# EasyEDA Pro project 数字电容表（嘉立创专业版）.epro, schematic 数字电容表原理图
Create Date: 2023-10-29; Page Name: P1; Project Name: STC12C5A32S2; Schematic Name: 数字电容表原理图; Update Date: 2023-12-10; Company: 嘉立创EDA; Page Size: A3; Version: V1.0
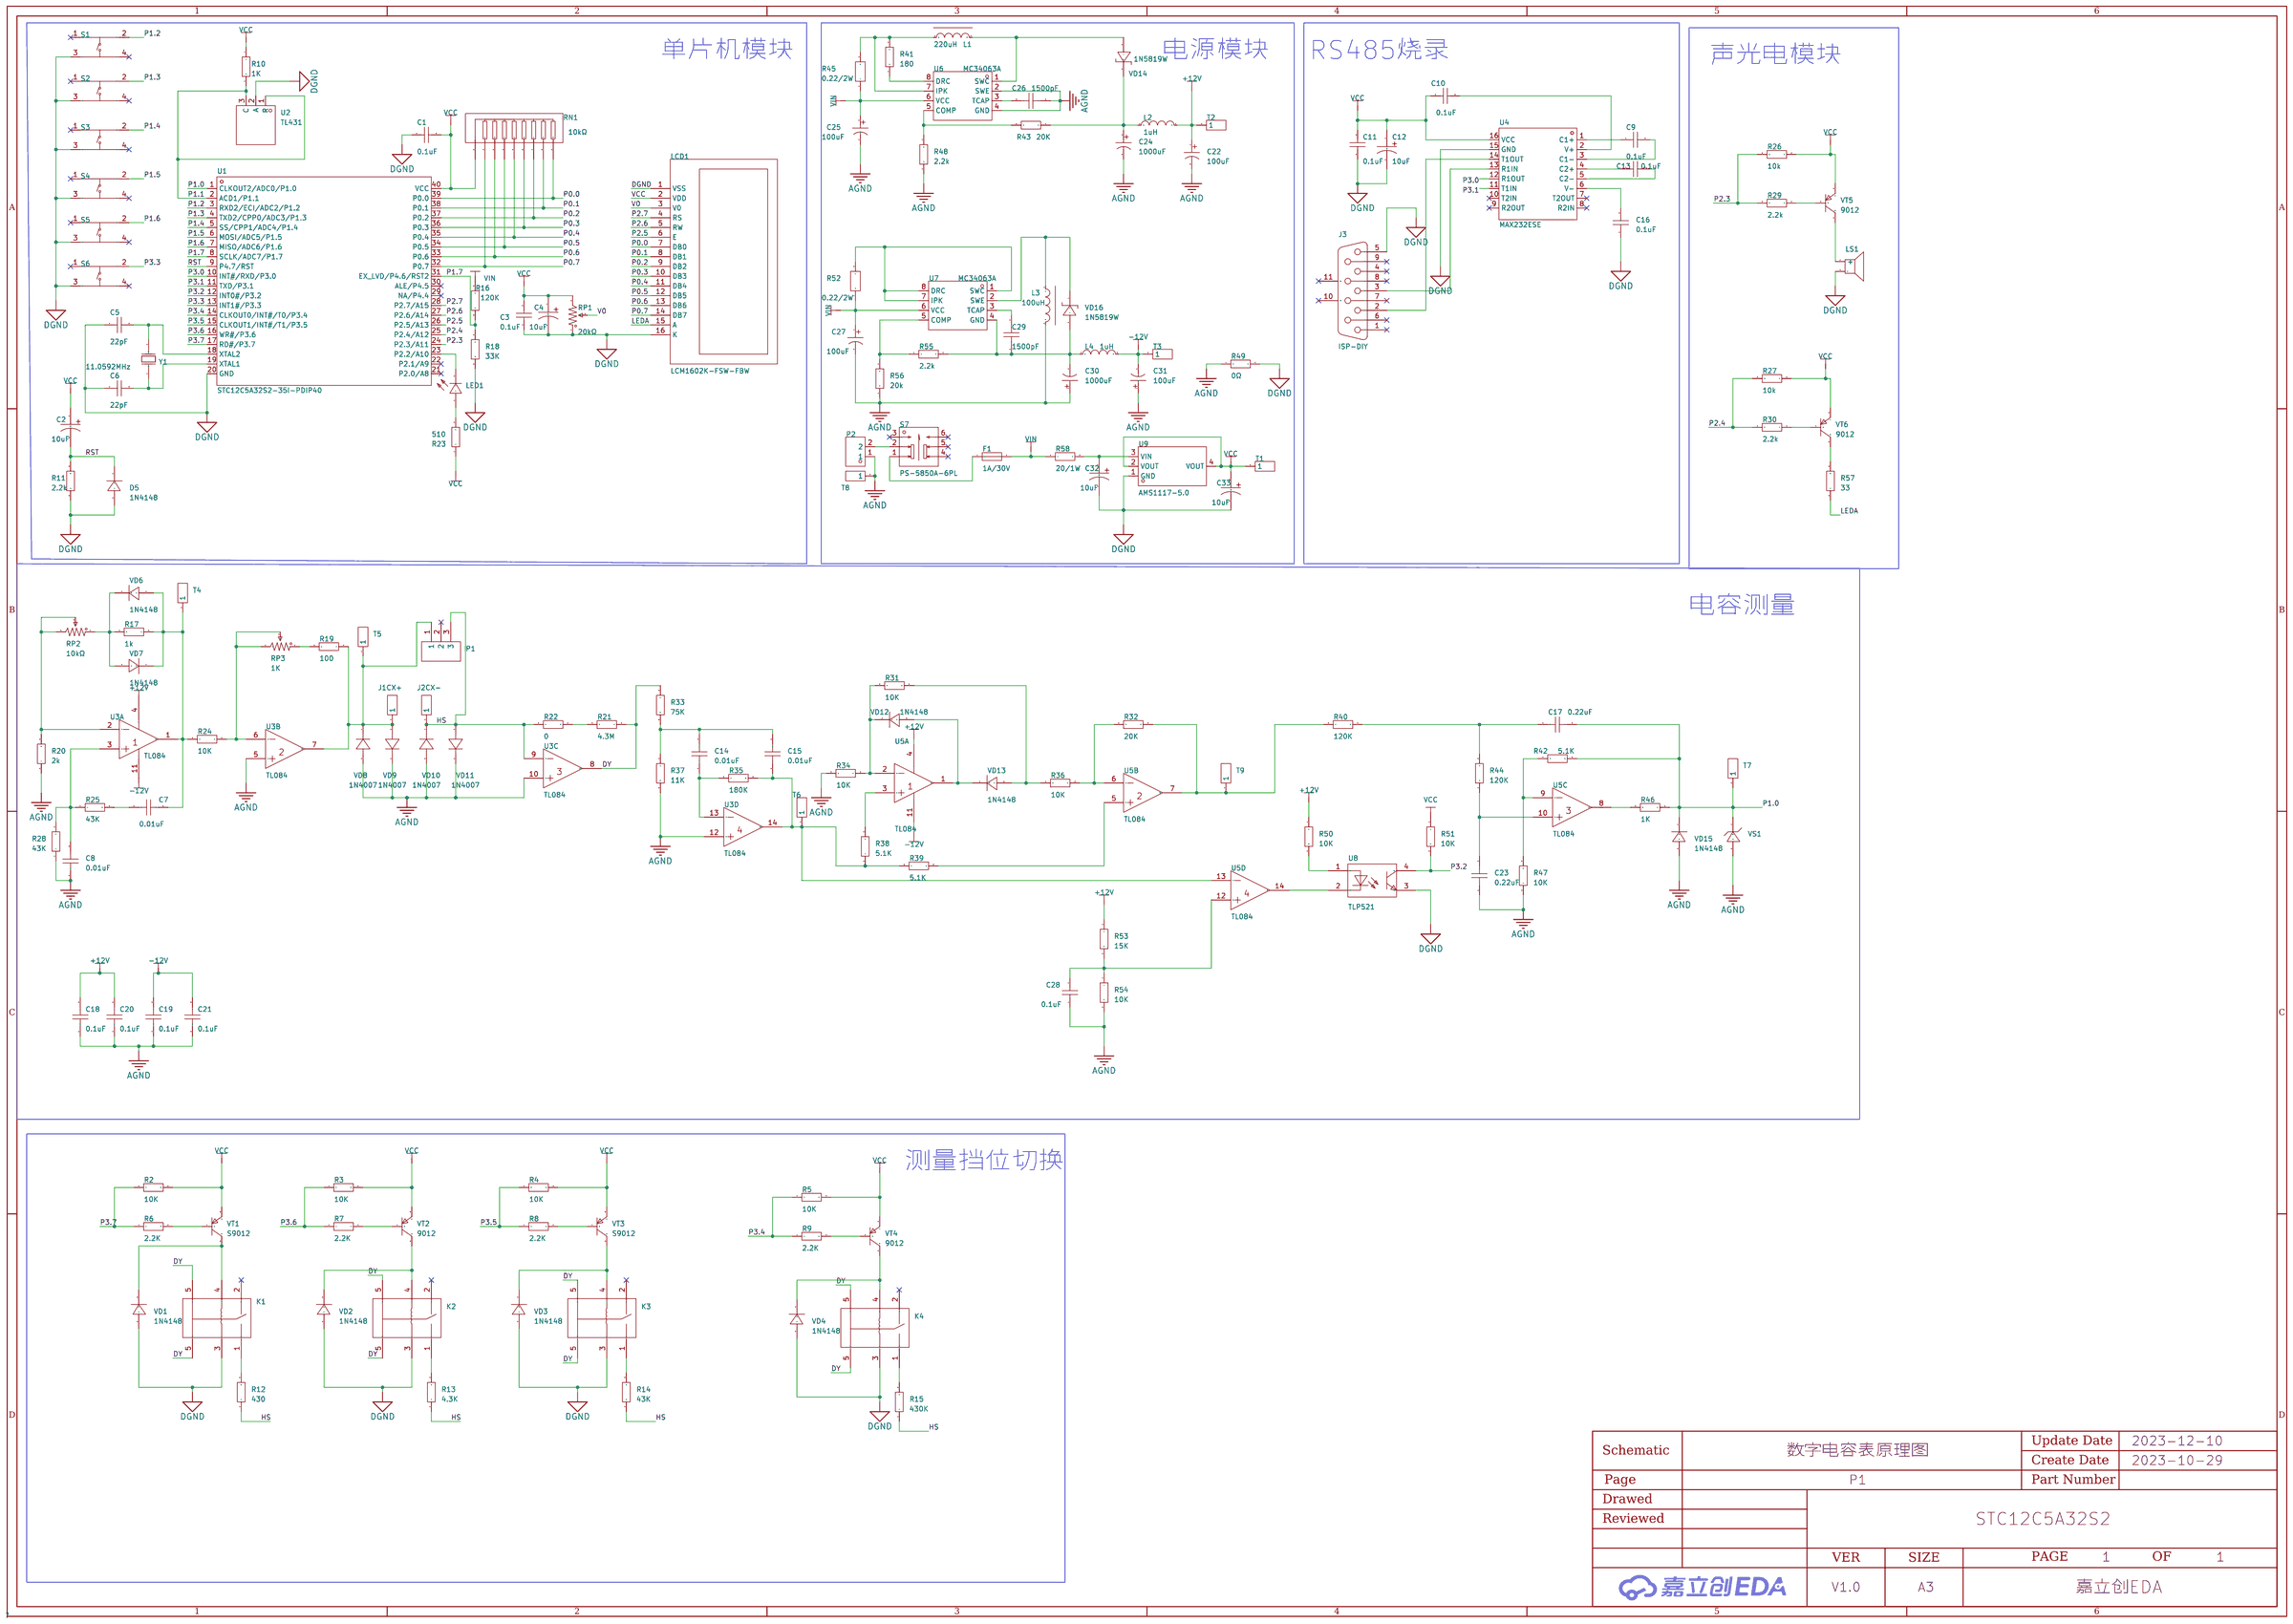
[diagram p0: schematic sheet]

## Parts
C1  0.1uF  [R0805_NEW]
C2  10uF  [CAP-SMD_L3.2-W1.6]
C3  0.1uF  [R0805_NEW]
C4  10uF  [CAP-SMD_L3.2-W1.6]
C5  22pF  [R0805_NEW]
C6  22pF  [R0805_NEW]
C7  0.01uF  [CAP-TH_L6.5-W3.5-P5.00-D0.6]
C8  0.01uF  [CAP-TH_L6.5-W3.5-P5.00-D0.6]
C9  0.1uF  [R0805_NEW]
C10  0.1uF  [R0805_NEW]
C11  0.1uF  [R0805_NEW]
C12  10uF  [CAP-SMD_L3.2-W1.6]
C13  0.1uF  [R0805_NEW]
C14  0.01uF  [CAP-TH_L6.5-W3.5-P5.00-D0.6]
C15  0.01uF  [CAP-TH_L6.5-W3.5-P5.00-D0.6]
C16  0.1uF  [R0805_NEW]
C17  0.22uF  [CAP-TH_L6.5-W3.5-P5.00-D0.6]
C18  0.1uF  [C0805]
C19  0.1uF  [C0805]
C20  0.1uF  [C0805]
C21  0.1uF  [C0805]
C22  100uF  [CAP-TH_BD6.3-P2.50-D1.0-FD]
C23  0.22uF  [CAP-TH_L6.5-W3.5-P5.00-D0.6]
C24  1000uF  [CAP-TH_BD10.0-P5.00-D1.0-FD]
C25  100uF  [CAP-TH_BD6.3-P2.50-D1.0-FD]
C26  1500pF  [CAP-TH_L6.5-W3.5-P5.00-D0.6]
C27  100uF  [CAP-TH_BD6.3-P2.50-D1.0-FD]
C28  0.1uF  [R0805_NEW]
C29  1500pF  [CAP-TH_L6.5-W3.5-P5.00-D0.6]
C30  1000uF  [CAP-TH_BD10.0-P5.00-D1.0-FD]
C31  100uF  [CAP-TH_BD6.3-P2.50-D1.0-FD]
C32  10uF  [CAP-SMD_L3.2-W1.6]
C33  10uF  [CAP-SMD_L3.2-W1.6]
D5  1N4148  [LL-34_L3.5-W1.5-RD]
F1  1A/30V  [FUSE-TH_L7.4-W3.1-P5.08-D1.2]
J1  J1CX+  [HDR-TH_1P-V-M_XKB_X4611WV-01I-C28D40]
J2  J2CX-  [HDR-TH_1P-V-M_XKB_X4611WV-01I-C28D40]
J3  ISP-DIY  [DSUB-TH_DMR-9S]
K1  HK4100F-DC5V-SHG  [RELAY-TH_HK4100F-DC5V-SHG]
K2  HK4100F-DC5V-SHG  [RELAY-TH_HK4100F-DC5V-SHG]
K3  HK4100F-DC5V-SHG  [RELAY-TH_HK4100F-DC5V-SHG]
K4  HK4100F-DC5V-SHG  [RELAY-TH_HK4100F-DC5V-SHG]
L1  220uH  [IND-TH_BD9.0-P5.00-D0.7]
L2  1uH  [IND-TH_BD3.0-L8.0-P12.00-D0.6]
L3  100uH  [IND-TH_BD9.5-P5.00-D0.7]
L4  1uH  [IND-TH_BD3.0-L8.0-P12.00-D0.6]
LCD1  LCM1602K-FSW-FBW  [MODULE-TH_LCM1602K]
LED1  204-10SUGD/S400-A5  [LED-TH_BD3.0-P2.54-FD]
LS1  2.3kHz  [BUZ-TH_BD12.0-P7.60-D0.6-FD]
P1  B3B-XH-A(LF)(SN)  [CONN-TH_3P-P2.50_A2501WV2-3P]
P2  PZ254V-11-02P  [HDR-TH_2P-P2.54-V-M]
R2  10K  [R0805]
R3  10K  [R0805]
R4  10K  [R0805]
R5  10K  [R0805]
R6  2.2K  [R0805]
R7  2.2K  [R0805]
R8  2.2K  [R0805]
R9  2.2K  [R0805]
R10  1K  [R0805]
R11  2.2k  [R0805]
R12  430  [R0805]
R13  4.3K  [R0805]
R14  43K  [R0805]
R15  430K  [R0805]
R16  120K  [R0805]
R17  1k  [R0805]
R18  33K  [R0805]
R19  100  [R0805]
R20  2k  [R0805]
R21  4.3M  [R0805]
R22  0  [R0805]
R23  510  [R0805]
R24  10K  [R0805]
R25  43K  [R0805]
R26  10k  [R0805]
R27  10k  [R0805]
R28  43K  [R0805]
R29  2.2k  [R0805]
R30  2.2k  [R0805]
R31  10K  [R0805]
R32  20K  [R0805]
R33  75K  [R0805]
R34  10K  [R0805]
R35  180K  [R0805]
R36  10K  [R0805]
R37  11K  [R0805]
R38  5.1K  [R0805]
R39  5.1K  [R0805]
R40  120K  [R0805]
R41  180  [R0805]
R42  5.1K  [R0805]
R43  20K  [R0805]
R44  120K  [R0805]
R45  0.22/2W  [RES-TH_BD4.5-L11.0-P15.00-D0.7]
R46  1K  [R0805]
R47  10K  [R0805]
R48  2.2k  [R0805]
R49  0Ω  [RES-TH_BD2.4-L6.3-P10.30-D0.6]
R50  10K  [R0805]
R51  10K  [R0805]
R52  0.22/2W  [RES-TH_BD4.5-L11.0-P15.00-D0.7]
R53  15K  [R0805]
R54  10K  [R0805]
R55  2.2k  [R0805]
R56  20k  [R0805]
R57  33  [R0805]
R58  20/1W  [RES-TH_BD4.5-L11.0-P15.00-D0.7]
RN1  10kΩ  [RES-ARRAY-TH_9P-P2.54-D1.0]
RP1  20kΩ  [RES-ADJ-TH_3P-L10.0-W10.0-P2.50-L]
RP2  10kΩ  [RES-ADJ-TH_3P-L10.0-W10.0-P2.50-L]
RP3  1K  [RES-ADJ-TH_3P-L10.0-W10.0-P2.50-L]
S1  TS665CJ  [SW-TH_4P-L6.0-W6.0-P4.50-LS6.5]
S2  TS665CJ  [SW-TH_4P-L6.0-W6.0-P4.50-LS6.5]
S3  TS665CJ  [SW-TH_4P-L6.0-W6.0-P4.50-LS6.5]
S4  TS665CJ  [SW-TH_4P-L6.0-W6.0-P4.50-LS6.5]
S5  TS665CJ  [SW-TH_4P-L6.0-W6.0-P4.50-LS6.5]
S6  TS665CJ  [SW-TH_4P-L6.0-W6.0-P4.50-LS6.5]
S7  PS-5850A-6PL  [SW-TH_6P-L5.8-W5.8-P2.00-LS4.5-BL]
T1  -  [HDR-TH_1P-V-M_XKB_X4611WV-01I-C28D40]
T2  -  [HDR-TH_1P-V-M_XKB_X4611WV-01I-C28D40]
T3  -  [HDR-TH_1P-V-M_XKB_X4611WV-01I-C28D40]
T4  -  [HDR-TH_1P-V-M_XKB_X4611WV-01I-C28D40]
T5  -  [HDR-TH_1P-V-M_XKB_X4611WV-01I-C28D40]
T6  -  [HDR-TH_1P-V-M_XKB_X4611WV-01I-C28D40]
T7  -  [HDR-TH_1P-V-M_XKB_X4611WV-01I-C28D40]
T8  -  [HDR-TH_1P-V-M_XKB_X4611WV-01I-C28D40]
T9  -  [HDR-TH_1P-V-M_XKB_X4611WV-01I-C28D40]
U1  STC12C5A32S2-35I-PDIP40  [DIP-40_L52.3-W13.9-P2.54-LS15.2-BL]
U2  TL431  [TO-92-3_L4.9-W3.7-P1.27-L]
U3  TL084  [DIP-14_L18.9-W6.4-P2.54-LS7.6-BL]  (sections 1,2,3,4)
U4  MAX232ESE  [SOP-16_L10.0-W3.9-P1.27-LS6.0-BL]
U5  TL084  [DIP-14_L18.9-W6.4-P2.54-LS7.6-BL]  (sections 1,2,3,4)
U6  MC34063A  [SOIC-8_L4.9-W3.9-P1.27-LS6.0-BL]
U7  MC34063A  [SOIC-8_L4.9-W3.9-P1.27-LS6.0-BL]
U8  TLP521  [DIP-4_L6.4-W4.6-P2.54-LS7.6-BL]
U9  AMS1117-5.0  [SOT-223_L6.5-W3.5-P2.30-LS7.0-BR]
VD1  1N4148  [LL-34_L3.5-W1.5-RD]
VD2  1N4148  [LL-34_L3.5-W1.5-RD]
VD3  1N4148  [LL-34_L3.5-W1.5-RD]
VD4  1N4148  [LL-34_L3.5-W1.5-RD]
VD6  1N4148  [LL-34_L3.5-W1.5-RD]
VD7  1N4148  [LL-34_L3.5-W1.5-RD]
VD8  1N4007  [SMA_L4.3-W2.5-LS5.0-RD]
VD9  1N4007  [SMA_L4.3-W2.5-LS5.0-RD]
VD10  1N4007  [SMA_L4.3-W2.5-LS5.0-RD]
VD11  1N4007  [SMA_L4.3-W2.5-LS5.0-RD]
VD12  1N4148  [LL-34_L3.5-W1.5-RD]
VD13  1N4148  [LL-34_L3.5-W1.5-RD]
VD14  1N5819W  [SMA_L4.3-W2.5-LS5.0-RD]
VD15  1N4148  [LL-34_L3.5-W1.5-RD]
VD16  1N5819W  [SMA_L4.3-W2.5-LS5.0-RD]
VS1  1N4733A  [DO-41_BD2.4-L4.7-P8.70-D0.9-RD]
VT1  S9012  [SOT-23-3_L2.9-W1.3-P1.90-LS2.4-BR]
VT2  9012  [SOT-23-3_L2.9-W1.3-P1.90-LS2.4-BR]
VT3  S9012  [SOT-23-3_L2.9-W1.3-P1.90-LS2.4-BR]
VT4  9012  [SOT-23-3_L2.9-W1.3-P1.90-LS2.4-BR]
VT5  9012  [SOT-23-3_L2.9-W1.3-P1.90-LS2.4-BR]
VT6  9012  [SOT-23-3_L2.9-W1.3-P1.90-LS2.4-BR]
Y1  11.0592MHz  [HC-49US_L11.5-W4.5-P4.88]

## Library data of the parts
C1 C3 C5 C6 C9-C11 C13 C16 C28 = C1608NP01H220J080AA: 容值:22pF;额定电压:50V;材质(温度系数):C0G;; LCSC Part Name: 22pF 50V; Supplier Part: C3893275; Manufacturer: TDK; Supplier: LCSC; Voltage Rated: 50V; Temperature Coefficient: C0G
C2 C4 C12 C32 C33 = F931A476MAA: 容值:47uF;精度:±20%;额定电压:10V;等效串联电阻:2Ω@100kHz;; LCSC Part Name: 47uF ±20% 10V; Supplier Part: C1952745; Manufacturer: Kyocera AVX; Supplier Footprint: 1206; JLCPCB Part Class: Extended Part; Supplier: LCSC; Tolerance: ±20%; Rated Voltage: 10V; Equivalent Series Resistance(ESR): 2Ω@100kHz; Operating Temperature: -55℃~+125℃
C7 = B1030630-D-10-3R: 容值:10nF;精度:±5%;额定电压:630V;; LCSC Part Name: 10nF ±5% 630V; Supplier Part: C5119335; Manufacturer: GDHY(广东华裕); Supplier Footprint: 插件,P=10mm; JLCPCB Part Class: Extended Part; Datasheet: https://atta.szlcsc.com/upload/public/pdf/source/20220727/B1F705536ABB462BEFD02ED8C071494F.pdf; Supplier: LCSC; Tolerance: ±5%; Voltage Rated: 630V; Operating Temperature: -40℃~+85℃
C8 = ECQE2103JF: 容值:10nF;精度:±5%;额定电压:250V;; LCSC Part Name: 10nF ±5% 250V; Supplier Part: C178437; Manufacturer: PANASONIC(松下); Supplier Footprint: 插件,P=7.5mm; JLCPCB Part Class: Extended Part; Datasheet: https://atta.szlcsc.com/upload/public/pdf/source/20180327/C178437_5B053C571BBDEBAA08A594159E95F6D8.pdf; Supplier: LCSC; Tolerance: ±5%; Voltage Rated: 250V; Operating Temperature: -40℃~+105℃
C14 C15 C17 C23 = KP106J2E2701: 容值:10uF;精度:±5%;额定电压:250V;; LCSC Part Name: 10uF ±5% 250V; Supplier Part: C5116053; Manufacturer: KYET(科雅); Supplier Footprint: 插件,P=27.5mm; JLCPCB Part Class: Extended Part; Datasheet: https://atta.szlcsc.com/upload/public/pdf/source/20220726/FB83A3335903AFF60787E7E0B4A03A74.pdf; Supplier: LCSC; Tolerance: ±5%; Voltage Rated: 250V; Operating Temperature: -40℃~+100℃
C18-C21 = 0805B104K500NT: 容值:100nF;精度:±10%;额定电压:50V;材质(温度系数):X7R;; LCSC Part Name: 100nF ±10% 50V; Supplier Part: C38141; Manufacturer: FH(风华); Supplier Footprint: 0805; JLCPCB Part Class: Extended Part; Datasheet: https://atta.szlcsc.com/upload/public/pdf/source/20170923/C38141_1506149447419988747.pdf; Supplier: LCSC; Tolerance: ±10%; Voltage Rated: 50V; Temperature Coefficient: X7R
C22 C24 C25 C31 = 35YXJ1000M12.5X20: 容值:1000uF;精度:±20%;额定电压:35V;; LCSC Part Name: 1000uF ±20% 35V; Supplier Part: C88743; Manufacturer: rubycon(红宝石); JLCPCB Part Class: Extended Part; Datasheet: https://atta.szlcsc.com/upload/public/pdf/source/20200113/C88743_7A9E1D91AFF2E9AFD34B160DBDD0EC66.pdf; Supplier: LCSC; Tolerance: ±20%; Rated Voltage: 35V; Lead Spacing: 5mm; Lifetime @ Temp: 10000hrs@105℃
C26 C29 = CT4-1206B104K251F3: 容值:100nF;精度:±10%;额定电压:250V;温度系数:X7R;; LCSC Part Name: 100nF ±10% 250V; Supplier Part: C93117; Manufacturer: FH(风华); Supplier Footprint: 插件,P=5.08mm; JLCPCB Part Class: Extended Part; Datasheet: https://atta.szlcsc.com/upload/public/pdf/source/20170116/1484561261692.pdf; Supplier: LCSC; Tolerance: ±10%; Voltage Rated: 250V; Temperature Coefficient: X7R
C27 = KS107M025E07RR0VH2FP0: 容值:100uF;精度:±20%;额定电压:25V;纹波电流:95mA@120Hz;等效串联电阻:-;; LCSC Part Name: 100uF ±20% 25V; Supplier Part: C44587; Manufacturer: CX(承兴); Supplier Footprint: 插件,D6.3xL7mm; JLCPCB Part Class: Extended Part; Datasheet: https://atta.szlcsc.com/upload/public/pdf/source/20211027/7B10195EF01EB9374BE8935690E3D906.pdf; Supplier: LCSC; Tolerance: ±20%; Rated Voltage: 25V; φD: 6.3mm; L: 7mm; Lead Spacing: 2.5mm; Ripple Current: 95mA@120Hz; Lifetime @ Temp: 1000hrs@105℃
C30 = 25PK1000MEFC10*16: 容值:1000uF;精度:±20%;额定电压:25V;纹波电流:870mA@120Hz;等效串联电阻:-;; LCSC Part Name: 1000uF ±20% 25V; Supplier Part: C109451; Manufacturer: rubycon(红宝石); Supplier Footprint: 插件,D10xL16mm; JLCPCB Part Class: Extended Part; Datasheet: https://atta.szlcsc.com/upload/public/pdf/source/20170428/1493376785021.pdf; Supplier: LCSC; Tolerance: ±20%; Rated Voltage: 25V; φD: 10mm; L: 16mm; Lead Spacing: 5mm; Ripple Current: 870mA@120Hz; Lifetime @ Temp: 2000hrs@85℃
D5 VD1-VD4 VD6 VD7 VD12 VD13 VD15 = 1N4148_C14516: 二极管配置:-;功率:500mW;直流反向耐压(Vr):75V;平均整流电流(Io):200mA;正向压降(Vf):1V@10mA;反向电流(Ir):5uA@75V;反向恢复时间(trr):4ns;工作温度:+200℃@(Tj);; LCSC Part Name: 75V 200mA 4ns; Supplier Part: C14516; Manufacturer: ST(先科); Supplier Footprint: DO-35; JLCPCB Part Class: Extended Part; Datasheet: https://atta.szlcsc.com/upload/public/pdf/source/20140303/1457707004955.pdf; Supplier: LCSC; Power Dissipation: 500mW; Reverse Voltage (Vr): 75V; Average Rectified Current (Io): 200mA; Forward Voltage (Vf@If): 1V@10mA; Reverse Leakage Current: 5uA@75V; Reverse Recovery Time (trr): 4ns; Operating Temperature: +200℃@(Tj)
F1 = JK30-135: 最大电压:30V;最大电流:40A;保持电流:1.35A;跳闸电流:1.7A;; LCSC Part Name: 30V 1.35A 插件自恢复; Supplier Part: C369101; Manufacturer: JK(金科); Supplier Footprint: 插件; JLCPCB Part Class: Extended Part; Datasheet: https://atta.szlcsc.com/upload/public/pdf/source/20190402/C369101_98A5AA25DF8DA14E018768A1458BEBD7.pdf; Supplier: LCSC; Operating Voltage (Max): 30V; Current Rating (Max): 40A; Hold Current: 1.35A; Trip Current: 1.7A; Power Dissipation: 800mW; Resistance - Initial (Ri) (Min): 70mΩ; Resistance - Post Trip (R1) (Max): 160mΩ; Maximum Time to Trip: 8s; Operating Temperature: -40℃~+85℃
J1 J2 T1-T9 = HDR-M_2.54_1x1P: Supplier Part: C81276; Supplier Footprint: 插件; JLCPCB Part Class: Extended Part
J3 = D-DMR009PF-D002: 连接器类型:D-Sub;公母:母;总PIN位数:9;排数:2;安装方式:弯插;额定电流:3A;工作温度范围:-50℃~+105℃;; LCSC Part Name: D-Sub 母 P数:9 DMR叉锁 半金; Supplier Part: C141882; Manufacturer: Ckmtw(灿科盟); Supplier Footprint: 插件; JLCPCB Part Class: Extended Part; Datasheet: https://atta.szlcsc.com/upload/public/pdf/source/20171123/C141882_15114109686951137625.pdf; Supplier: LCSC; Connector Type: D-Sub; Gender: 母; Number of Pins: 9; Number of Rows: 2; Mounting Style: 弯插; Current Rating (Max): 3A; Operating Temperature Range: -50℃~+105℃
K1-K3 = HK4100F-DC5V-SHG: 线圈电压:-;线圈类型:-;触点形式:-;最大切换电流:-;触点材料:-;; Supplier Part: C12072; Manufacturer: 汇科; Supplier Footprint: DIP,10.5x14.5mm; JLCPCB Part Class: Extended Part; Datasheet: https://atta.szlcsc.com/upload/public/pdf/source/20190505/C12072_12082CF268DDA70E6F1E676DA276DDA8.pdf; Supplier: LCSC
K4 = HK4100F-DC5V-SHG: 线圈电压:-;线圈类型:-;触点形式:-;最大切换电流:-;触点材料:-;; Supplier Part: f; Manufacturer: 汇科; Supplier Footprint: DIP,10.5x14.5mm; JLCPCB Part Class: Extended Part; Datasheet: https://atta.szlcsc.com/upload/public/pdf/source/20190505/C12072_12082CF268DDA70E6F1E676DA276DDA8.pdf; Supplier: LCSC
L1 = 工字电感: 电感值:220uH;精度:±20%;额定电流:600mA;; Supplier: LCSC; Supplier Part: C400317; Manufacturer: SXN(顺翔诺); Manufacturer Part: PK0810-221MB; JLCPCB Part Class: Extended Part; LCSC Part Name: 220uH ±20% 600mA 350mΩ; Supplier Footprint: 插件; Datasheet: https://atta.szlcsc.com/upload/public/pdf/source/20210810/BA6D1DA7D4BCBB7C641BC97B42CFC6FF.pdf; Tolerance: ±20%; Rated Current: 600mA; DC Resistance (DCR): 350mΩ
L2 L4 = CKL0510-1mH/K-A-0.252MHz T: 类型:色环电感;电感值:1mH;精度:±10%;额定电流:100mA;直流电阻(DCR):8Ω;Q值:50@0.252MHz;自谐频率:1MHz;; LCSC Part Name: 1mH ±10% 100mA 8Ω; Supplier Part: C354679; Manufacturer: CENKER(岑科); Supplier Footprint: 插件,D5xL11mm; JLCPCB Part Class: Extended Part; Datasheet: https://atta.szlcsc.com/upload/public/pdf/source/20190315/C354679_C0281614A754FCB6C690AF872C63A006.pdf; Supplier: LCSC; Type: 色环电感; Tolerance: ±10%; Rated Current: 100mA; DC Resistance: 8Ω; Q @ Frequency: 50@0.252MHz; Frequency - Self Resonant: 1MHz
L3 = VLU0810-102K: 电感值:1mH;精度:±10%;额定电流:360mA;; LCSC Part Name: 1mH ±10% 360mA; Supplier Part: C72626; Manufacturer: FH(风华); Supplier Footprint: 插件; JLCPCB Part Class: Extended Part; Datasheet: https://atta.szlcsc.com/upload/public/pdf/source/20160613/1465800080994.pdf; Supplier: LCSC; Tolerance: ±10%; Rated Current: 360mA
LCD1 = LCM1602K-FSW-FBW: 尺寸(inch):-;主控芯片:KS0066U;; Supplier Part: C83274; Manufacturer: LONTECH(厦门龙特); JLCPCB Part Class: Extended Part; Datasheet: https://atta.szlcsc.com/upload/public/pdf/source/20161111/1478835373818.pdf; Supplier: LCSC; Main Control Chip: KS0066U
LED1 = 204-10SUGD/S400-A5: 发光颜色:翠绿;二极管配置:-;主波长:530nm;色温:-;功率:110mW;安装方式:-;; LCSC Part Name: 翠绿 引脚长18mm; Supplier Part: C99761; Manufacturer: EVERLIGHT(亿光); Supplier Footprint: 插件,D=3mm; JLCPCB Part Class: Extended Part; Datasheet: https://atta.szlcsc.com/upload/public/pdf/source/20190311/C99761_45F71091A0F073B983B2689408558B89.pdf; Supplier: LCSC; Emitted Color: 翠绿; Lens Color: 雾状绿; Dominant Wavelength: 530nm; Peak Wavelength: 525nm; Forward Current: 20mA; Power Dissipation: 110mW; Viewing Angle: 30°; Operating Temperature: -40℃~+85℃; Lamp Holder Type: 3mm圆形灯头
LS1 = TMB12A05_C96093: 驱动方式:有源(内含驱动线路);构造类型:电磁式;额定电压:5V;频率:2.3kHz;声压(SPL):85dB@5V,10cm;; LCSC Part Name: TMB12A05; Supplier Part: C96093; Manufacturer: 华能; Manufacturer Part: TMB12A05; Supplier Footprint: 插件,D=12mm; JLCPCB Part Class: Extended Part; Datasheet: https://atta.szlcsc.com/upload/public/pdf/source/20170522/1495448324811.pdf; Supplier: LCSC; Oscillator Circuit: 有源(内含驱动线路); Technology Type: 电磁式; Rated Voltage: 5V; Operating Voltage: 4V~8V; Sound Pressure Level (SPL): 85dB@5V,10cm; Diameter (φD): 12mm; Height: 9.8mm
P1 = B3B-XH-A(LF)(SN): 参考系列:XH;间距:2.5mm;插针结构:1x3P;排数:1;每排PIN数:3;行距:-;安装方式:-;触头材质:黄铜;; LCSC Part Name: XH 2.5mm 1x3P; Supplier Part: C144394; Manufacturer: JST; Supplier Footprint: 插件,P=2.5mm; JLCPCB Part Class: Extended Part; Datasheet: https://atta.szlcsc.com/upload/public/pdf/source/20180327/C144394_40EBA2F68C817AED706C9EFF4B81600D.pdf; Supplier: LCSC; Reference Series: XH; Pitch: 2.5mm; Pins Structure: 1x3P; Number of Rows: 1; Number of PINs Per Row: 3; Contact Material: 黄铜
P2 = PZ254V-11-02P: 排数:单排;总PIN位数:2;间距:2.54mm;插针结构:1x2P;行距:-;安装类型:直插;圆针/方针:方针;额定电流:-;额定电压:-;配合针长度:6mm;塑高:2.5mm;端接针长度:3mm;触头材质:黄铜;触头镀层:-;工作温度范围:-40℃~+105℃;颜色:黑色;; LCSC Part Name: 2.54mm 1x2P 直插 方针; Supplier Part: C492401; Manufacturer: XFCN(兴飞); Supplier Footprint: 直插,P=2.54mm; JLCPCB Part Class: Extended Part; Datasheet: https://atta.szlcsc.com/upload/public/pdf/source/20200309/C492401_A812433581A9B211A7FFA413ADDFF0E5.pdf; Supplier: LCSC; Number of Rows: 单排; Number of Pins: 2; Pitch: 2.54mm; Pin Structure: 1x2P; Mounting Type: 直插; Circluar Pins/Square Pins: 方针; Length of Mating Pin: 6mm; Insulation Height: 2.5mm; Length of End Connection Pin: 3mm; Contact Material: 黄铜; Operating Temperature Range: -40℃~+105℃; Color: 黑色
R2-R44 R46-R48 R50 R51 R53-R57 = RN73H2ATTD5050B10: 电阻类型:金属膜电阻;阻值:505Ω;精度:±0.1%;功率:125mW;; LCSC Part Name: 金属膜电阻 505Ω ±0.1% 125mW; Supplier Part: C4038486; Manufacturer: KOA; Supplier Footprint: 0805; JLCPCB Part Class: Extended Part; Supplier: LCSC; Type: 金属膜电阻; Tolerance: ±0.1%; Power(Watts): 125mW; Temperature Coefficient: ±10ppm/℃; Operating Temperature Range: -55℃~+155℃
R45 R52 = RN1/4W10KFT/BA1: 电阻类型:金属膜电阻;阻值:10kΩ;精度:±1%;功率:250mW;温度系数:±50ppm/℃;最大工作电压:250V;工作温度范围:-55℃~+125℃;; LCSC Part Name: 金属膜电阻 10kΩ ±1% 250mW; Supplier Part: C410695; Manufacturer: Tyohm(幸亚电阻); Supplier Footprint: 插件; JLCPCB Part Class: Extended Part; Datasheet: https://atta.szlcsc.com/upload/public/pdf/source/20190808/C410695_F4C96186075092C4BC649A77CE7E5B2A.pdf; Supplier: LCSC; Type: 金属膜电阻; Tolerance: ±1%; Power(Watts): 250mW; Temperature Coefficient: ±50ppm/℃; Overload Voltage (Max): 250V; Operating Temperature Range: -55℃~+125℃
R49 = MFR-25-T-52-0R: 电阻类型:金属膜电阻;阻值:0Ω;功率:250mW;; LCSC Part Name: 金属膜电阻 0Ω 250mW; Supplier Part: C173063; Manufacturer: YAGEO(国巨); Supplier Footprint: 轴向引线; JLCPCB Part Class: Extended Part; Datasheet: https://atta.szlcsc.com/upload/public/pdf/source/20180412/C173063_41E3BD699D8AF9D25B7A0B67A7393779.pdf; Supplier: LCSC; Type: 金属膜电阻; Power(Watts): 250mW
R58 = KNP5W-0Ω51±5%-CP: 阻值:510mΩ;精度:±5%;功率:5W;; LCSC Part Name: 510mΩ ±5% 5W; Supplier Part: C5144923; Manufacturer: VO(翔胜); Supplier Footprint: 插件,8x25mm; JLCPCB Part Class: Extended Part; Datasheet: https://atta.szlcsc.com/upload/public/pdf/source/20220829/5E039AC9F0FE2263280A90A7AE6A183F.pdf; Supplier: LCSC; Tolerance: ±5%; Power(Watts): 5W
RN1 = A09-103JP: 阻值:10kΩ;精度:±5%;单个元件功率:125mW;电阻器数:8;; LCSC Part Name: 10kΩ ±5%; Supplier Part: C8692; Manufacturer: FH(风华); Supplier Footprint: SIP-9-2.54mm; JLCPCB Part Class: Extended Part; Datasheet: https://atta.szlcsc.com/upload/public/pdf/source/20140224/1457706855244.pdf; Supplier: LCSC; Tolerance: ±5%; Power(Watts): 125mW; Number of Resistors: 8; Number of Pins: 9; Temperature Coefficient: ±100ppm/℃
RP1-RP3 = 3296W-1-103: 阻值:10kΩ;精度:±10%;; LCSC Part Name: 10kΩ ±10%; Supplier Part: C118954; Manufacturer: BOCHEN(博晨); Supplier Footprint: 插件; JLCPCB Part Class: Extended Part; Datasheet: https://atta.szlcsc.com/upload/public/pdf/source/20171114/C118954_15106326646611117443.pdf; Supplier: LCSC; Tolerance: ±10%
S1-S6 = TS665CJ: 触点电流:50mA;额定电压(DC):12V;电路结构:单刀单掷;安装方式:直插;带灯:-;机械寿命:-;; LCSC Part Name: 6*6*5mm 直插 轻触开关; Supplier Part: C393938; Manufacturer: SHOU HAN(首韩); Supplier Footprint: 插件; JLCPCB Part Class: Extended Part; Datasheet: https://atta.szlcsc.com/upload/public/pdf/source/20190521/C393938_BDABEAC600B4C55E200A80AA129B70BC.pdf; Supplier: LCSC; Contact Current: 50mA; Voltage Rating (DC): 12V; Circuit: 单刀单掷; Mounting Style: 直插; Actuator Style: 圆形按钮; Switch Length: 6mm; Switch Width: 6mm; Switch Height: 5mm
S7 = PS-5850A-6PL: 5.8自锁按键开关 高头 耐高温; LCSC Part Name: 自锁按键开关; Supplier Part: C963201; Manufacturer: G-Switch(品赞); Supplier Footprint: 插件,5.8x5.8x10mm; JLCPCB Part Class: Extended Part; Datasheet: https://atta.szlcsc.com/upload/public/pdf/source/20201201/C963201_9229C247AC907A82E381B4EE0BC1DEDE.pdf; Supplier: LCSC
U1 = STC12C5A32S2-35I-PDIP40: CPU内核:51系列;CPU最大主频:35MHz;程序存储容量:32KB;程序存储器类型:FLASH;RAM总容量:1.25KB;GPIO端口数量:36;; LCSC Part Name: 51系列 35MHz; Supplier Part: C66940; Manufacturer: STC(宏晶); Supplier Footprint: DIP-40; JLCPCB Part Class: Extended Part; Datasheet: https://atta.szlcsc.com/upload/public/pdf/source/20161108/1478586393832.pdf; Supplier: LCSC; CPU Core: 51系列; CPU Maximum Speed: 35MHz; Operating Voltage Range: 4V~5.5V; Program Storage Size: 32KB; Program Memory Type: FLASH; RAM Size: 1.25KB; EEPROM: 32KB; GPIO Ports Number: 36; ADC (Bit): 10bit; 16Bit Timer: 2; UART/USART: 2; SPI: 1; Peripheral/Function: 低电压检测；看门狗；CCP捕获/比较; Watchdog: 有; Low-Voltage Detect: 有; CCP Capture/Compare: 有; Internal Oscillator: 有; Operating Temperature Range: -40℃~+85℃
U2 = TL431C: 输出类型:可调;输出电压:2.495V~40V;输出电流:150mA;最小阴极电流调节:500uA;工作温度:-40℃~+125℃@(TA);; LCSC Part Name: 2.495V~40V 150mA; Supplier Part: C262796; Manufacturer: HTC; Supplier Footprint: TO-92-3; JLCPCB Part Class: Extended Part; Datasheet: https://atta.szlcsc.com/upload/public/pdf/source/20180803/C262796_411D3FF7FC257818DC18E6AA6FF240C4.pdf; Supplier: LCSC; Output Type: 可调; Output Voltage: 2.495V~40V; Output Current: 150mA; Minimum Cathode Current for Regulation: 500uA; Operating Temperature: -40℃~+125℃@(TA)
U3 U5 = TL084_C5157925: Supplier Part: C5157925; Manufacturer: Gcore(扬州国芯); Supplier Footprint: DIP-14; Datasheet: https://atta.szlcsc.com/upload/public/pdf/source/20220906/4A3C9A833388D8821B4E2BF6E8F7B3C0.pdf; Supplier: LCSC
U4 = MAX232ESE: 类型:收发器;驱动器/接收器:2/2;数据速率:120Kbps;; Supplier Part: C2904791; Manufacturer: UMW(广东友台半导体); Supplier Footprint: SOP-16; JLCPCB Part Class: Extended Part; Datasheet: https://atta.szlcsc.com/upload/public/pdf/source/20211013/7A8D650FA305A819D867682DD3523176.pdf; Supplier: LCSC; Types: 收发器; Driver/receiver: 2/2; Data Rate: 120Kbps; Supply Voltage: 4.5V~5.5V; Whether the isolation: 否; charge pump: 有; Operating Temperature: -40℃~+85℃
U6 U7 = MC34063A: Supplier Part: C5330394; Manufacturer: Slkor(萨科微); Supplier Footprint: SOP-8; JLCPCB Part Class: Extended Part; Datasheet: https://atta.szlcsc.com/upload/public/pdf/source/20230302/4A0E54F24E3FB81B5057EC6FE0D10CD6.pdf; Supplier: LCSC
U8 = CYTLP521-1(GB): 输入电压类型:DC;输出通道数:1;正向电压:1.4V;反向电压:6V;输出电流:50mA;接收端电压:80V;集射极饱和电压(Vce(sat)@Ic,IF):250mV@5mA,2mA;隔离电压(rms):5kV;; LCSC Part Name: DC输入 隔离电压(rms):5000V; Supplier Part: C385051; Manufacturer: OCIC(卓睿科); Supplier Footprint: DIP-4; JLCPCB Part Class: Extended Part; Datasheet: https://atta.szlcsc.com/upload/public/pdf/source/20190506/C385051_7901CCBB52669F8EFFA70B18D166A733.pdf; Supplier: LCSC; Input voltage type: DC; Output Type: 光电三极管; Number of Outputs: 1; Forward Voltage: 1.4V; Reverse Voltage: 6V; Output Current: 50mA; Receiving End Voltage: 80V; Collector-Emitter Saturation Voltage (Vce(sat)@Ic,IF): 250mV@5mA,2mA; Rise time: 2us@2mA,100Ω; Fall time: 3us@2mA,100Ω; Isolation Voltage(rms): 5kV; Operating Temperature: -55℃~+110℃
U9 = AMS1117-5.0_C6187: 输出类型:固定;输出极性:正;最大输入电压:15V;输出电压:5V;输出电流:1A;电源纹波抑制比(PSRR):68dB@(120Hz);; Supplier Part: C6187; Manufacturer: AMS; Supplier Footprint: SOT-223; JLCPCB Part Class: Basic Part; Datasheet: https://atta.szlcsc.com/upload/public/pdf/source/20180727/C6186_7A095716F0823C02F1997A905E26C086.pdf; Supplier: LCSC; Output Type: 固定; Output Polarity: 正; Number of Outputs: 1; Maximum Input Voltage: 15V; Output Voltage: 5V; Dropout Voltage: 1.3V@(1A); Output Current: 1A; Power Supply Rejection Ratio (PSRR): 68dB@(120Hz)
VD8-VD11 = 1N4007_C727081: 正向压降(Vf):1.1V 1A;反向电流(Ir):5uA 1kV;直流反向耐压(Vr):1kV;二极管配置:独立式;平均整流电流(Io):1A;; Supplier Part: C727081; Manufacturer: TWGMC(台湾迪嘉); Supplier Footprint: SMA(DO-214AC); JLCPCB Part Class: Extended Part; Datasheet: https://atta.szlcsc.com/upload/public/pdf/source/20200828/C727079_3A05254382567072883400655AE0ED46.pdf; Supplier: LCSC; Forward Voltage (Vf@If): 1.1V 1A; Reverse Leakage Current: 5uA 1kV; Reverse Voltage (Vr): 1kV; Diode Configuration: 独立式; Average Rectified Current (Io): 1A
VD14 VD16 = 1N5819W_C727115: 直流反向耐压(Vr):40V;平均整流电流(Io):1A;正向压降(Vf):600mV@1A;; Supplier Part: C727115; Manufacturer: TWGMC(台湾迪嘉); Supplier Footprint: SOD-123; JLCPCB Part Class: Extended Part; Datasheet: https://atta.szlcsc.com/upload/public/pdf/source/20200828/C727113_260B72EC53C389C21DF1E8AB243F1BFC.pdf; Supplier: LCSC; Reverse Voltage (Vr): 40V; Average Rectified Current (Io): 1A; Forward Voltage (Vf@If): 600mV@1A
VS1 = 1N4733A_C140851: 二极管配置:独立式;稳压值(标称值):5.1V;稳压值(范围):4.845V~5.355V;功率:1W;精度:±5%;; Supplier Part: C140851; Manufacturer: onsemi(安森美); Supplier Footprint: 插件,D2.03xL4.06mm; JLCPCB Part Class: 扩展库; Datasheet: https://atta.szlcsc.com/upload/public/pdf/source/20180207/C181831_15179898914631356522.pdf; Supplier: LCSC; Diode Configuration: 独立式; Zener Voltage (Nom): 5.1V; Reverse Leakage Current (Ir): 10uA@1V; Zener Voltage (Range): 4.845V~5.355V; Power Dissipation: 1W; Zener Impedance (Zzt): 7Ω; Tolerance: ±5%
VT1 VT3 = S9012_C842815: 晶体管类型:-;集射极击穿电压(Vceo):-;集电极电流(Ic):-;功率(Pd):-;集电极截止电流(Icbo):-;集电极-发射极饱和电压(VCE(sat)@Ic,Ib):-;特征频率(fT):-;; Supplier Part: C842815; Manufacturer: FUXINSEMI(富芯森美); Supplier Footprint: SOT-23; JLCPCB Part Class: Extended Part; Datasheet: https://atta.szlcsc.com/upload/public/pdf/source/20200930/C842815_108527B5FBAC3A2531EDC72D81138B6F.pdf; Supplier: LCSC
VT2 VT4-VT6 = S9012_C842815: 晶体管类型:-;集射极击穿电压(Vceo):-;集电极电流(Ic):-;功率(Pd):-;集电极截止电流(Icbo):-;集电极-发射极饱和电压(VCE(sat)@Ic,Ib):-;特征频率(fT):-;; LCSC Part Name: S9012; Supplier Part: C842815; Manufacturer: FUXINSEMI(富芯森美); Supplier Footprint: SOT-23; JLCPCB Part Class: Extended Part; Datasheet: https://atta.szlcsc.com/upload/public/pdf/source/20200930/C842815_108527B5FBAC3A2531EDC72D81138B6F.pdf; Supplier: LCSC
Y1 = X49SD110592MSD2SC: 频率:11.0592MHz;频率公差:±20ppm;频率稳定度:±30ppm;负载电容:20pF;; LCSC Part Name: 11.0592MHz ±20ppm 负载电容:20pF; Supplier Part: C2203; Manufacturer: YXC(扬兴晶振); Supplier Footprint: HC-49S; JLCPCB Part Class: Extended Part; Datasheet: https://atta.szlcsc.com/upload/public/pdf/source/20210903/A997D130AE99CBB55D9024F9BE6DA174.pdf; Supplier: LCSC; Crystal Type: 49S晶振; Frequency Tolerance: ±20ppm; Frequency Stability: ±30ppm; Load Capacitance: 20pF; Operating Temperature: -20℃~+70℃

## Nets
+12V: C18.2 C20.2 C22.1 L2.2 R50.1 R53.1 T2.1 U3.4(V+) U5.4(V+)
-12V: C19.2 C21.2 C31.2 L4.2 T3.1 U3.11(V-) U5.11(V-)
AGND: C8.1 C18.1 C19.1 C20.1 C21.1 C22.2 C23.2 C24.2 C25.2 C26.1 C27.2 C28.1 C30.1 C31.1 L3.2 P2.1 R20.1 R28.1 R34.1 R37.2 R47.1 R48.1 R49.1 R54.2 R56.2 T8.1 U3.5(IN+) U3.10(IN+) U3.12(IN+) U6.2(SWE) U6.4(GND) VD8.2(A) VD9.1(K) VD10.2(A) VD11.1(K) VD15.2(A) VS1.2(A)
DGND: C1.1 C3.1 C4.2 C5.1 C6.1 C11.1 C12.2 C16.1 C32.2 C33.2 D5.2(A) J3.5 K1.3 K2.3 K3.3 K4.3 LCD1.1(VSS) LCD1.16(K) LS1.2 R11.1 R18.2 R49.2 RP1.1 S1.3(C) S2.3(C) S3.3(C) S4.3(C) S5.3(C) S6.3(C) U1.20(GND) U2.2(A) U4.15(GND) U8.3(EMI) U9.1(GND) VD1.2(A) VD2.2(A) VD3.2(A) VD4.2(A)
V0: LCD1.3(V0) RP1.2
VCC: C1.2 C2.1 C3.2 C4.1 C10.2 C11.2 C12.1 C33.1 LCD1.2(VDD) R2.2 R3.2 R4.2 R5.2 R10.1 R23.1 R26.1 R27.1 R51.1 RN1.1 RP1.3 T1.1 U1.40(VCC) U4.16(VCC) U9.2(VOUT) U9.4(VOUT) VT1.2(E) VT2.2(E) VT3.2(E) VT4.2(E) VT5.2(E) VT6.2(E)
VIN: C25.1 C27.1 F1.2 R16.1 R45.1 R52.1 R58.1 U6.6(VCC) U7.6(VCC)
DY: K1.5 K2.5 K3.5 K4.5 R21.1 R33.1 U3.8(OUT)
HS: J2.1 P1.3 R12.1 R13.1 R14.1 R15.1 R22.2 U3.9(IN-) VD10.1(K) VD11.2(A)
LEDA: LCD1.15(A) R57.1
P0.0: LCD1.7(DB0) RN1.9 U1.39(P0.0)
P0.1: LCD1.8(DB1) RN1.8 U1.38(P0.1)
P0.2: LCD1.9(DB2) RN1.7 U1.37(P0.2)
P0.3: LCD1.10(DB3) RN1.6 U1.36(P0.3)
P0.4: LCD1.11(DB4) RN1.5 U1.35(P0.4)
P0.5: LCD1.12(DB5) RN1.4 U1.34(P0.5)
P0.6: LCD1.13(DB6) RN1.3 U1.33(P0.6)
P0.7: LCD1.14(DB7) RN1.2 U1.32(P0.7)
P1.0: C17.2 R42.2 R46.1 T7.1 U1.1(CLKOUT2/ADC0/P1.0) VD15.1(C) VS1.1(C)
P1.1: R10.2 U1.2(ACD1/P1.1) U2.1(R) U2.3(C)
P1.2: S1.2(B) U1.3(RXD2/ECI/ADC2/P1.2)
P1.3: S2.2(B) U1.4(TXD2/CPP0/ADC3/P1.3)
P1.4: S3.2(B) U1.5(SS/CPP1/ADC4/P1.4)
P1.5: S4.2(B) U1.6(MOSI/ADC5/P1.5)
P1.6: S5.2(B) U1.7(MISO/ADC6/P1.6)
P1.7: R16.2 R18.1 U1.8(SCLK/ADC7/P1.7) U1.31(EX_LVD/P4.6/RST2)
P2.3: R26.2 R29.2 U1.24(P2.3/A11)
P2.4: R27.2 R30.2 U1.25(P2.4/A12)
P2.5: LCD1.6(E) U1.26(P2.5/A13)
P2.6: LCD1.5(RW) U1.27(P2.6/A14)
P2.7: LCD1.4(RS) U1.28(P2.7/A15)
P3.0: U1.10(INT#/RXD/P3.0) U4.12(R1OUT)
P3.1: U1.11(TXD/P3.1) U4.11(T1IN)
P3.2: R51.2 U1.12(INT0#/P3.2) U8.4(COL)
P3.3: S6.2(B) U1.13(INT1#/P3.3)
P3.4: R5.1 R9.1 U1.14(CLKOUT0/INT#/T0/P3.4)
P3.5: R4.1 R8.1 U1.15(CLKOUT1/INT#/T1/P3.5)
P3.6: R3.1 R7.1 U1.16(WR#/P3.6)
P3.7: R2.1 R6.1 U1.17(RD#/P3.7)
RST: C2.2 D5.1(C) R11.2 U1.9(P4.7/RST)
$1N2346: LED1.2(K) U1.23(P2.2/A10)
$1N3452: R41.1 U6.8(DRC)
$1N4778: L1.2 U6.1(SWC) VD14.2(A)
$1N4799: C26.2 U6.3(TCAP)
$1N5364: C29.2 U7.3(TCAP)
$1N6563: R52.2 U7.1(SWC) U7.7(IPK) U7.8(DRC)
$1N6721: R55.1 R56.1 U7.5(COMP)
$1N6933: L3.1 U7.2(SWE) VD16.1(C)
$1N7062: C29.1 C30.2 L4.1 R55.2 U7.4(GND) VD16.2(A)
$1N8472: C16.2 U4.6(V-)
$1N8708: R30.1 VT6.1(B)
$1N8711: R57.2 VT6.3(C)
$1N8878: R29.1 VT5.1(B)
$1N8964: LS1.1(+) VT5.3(C)
$1N10683: R20.2 RP2.2 RP2.3 U3.2(IN-)
$1N10733: R17.1 RP2.1 VD6.1(C) VD7.2(A)
$1N10963: C7.1 R25.2
$1N11118: C8.2 R25.1 R28.2 U3.3(IN+)
$1N11381: R24.1 RP3.2 RP3.3 U3.6(IN-)
$1N11443: R19.2 RP3.1
$1N11625: C7.2 R17.2 R24.2 T4.1 U3.1(OUT) VD6.2(A) VD7.1(C)
$1N12335: R21.2 R22.1
$1N12640: C14.1 C15.1 R33.2 R37.1
$1N12663: C14.2 R35.1 U3.13(IN-)
$1N15631: R38.1 U5.3(IN+)
$1N15730: R31.2 R34.2 U5.2(IN-) VD12.1(C)
$1N15734: U5.1(OUT) VD12.2(A) VD13.1(C)
$1N15742: R31.1 R36.1 VD13.2(A)
$1N15748: R32.1 R36.2 U5.6(IN-)
$1N15796: R39.1 U5.5(IN+)
$1N16442: R46.2 U5.8(OUT)
$1N16458: R42.1 R47.2 U5.9(IN-)
$1N16661: R50.2 U8.1(AN)
$1N16668: U5.14(OUT) U8.2(CAT)
$1N16931: C15.2 R35.2 R38.2 R39.2 T6.1 U3.14(OUT) U5.13(IN-)
$1N17348: R6.2 VT1.1(B)
$1N17399: K1.1 R12.2
$1N17441: K1.4 VD1.1(C) VT1.3(C)
$1N18975: R7.2 VT2.1(B)
$1N18989: K2.1 R13.2
$1N19002: K2.4 VD2.1(C) VT2.3(C)
$1N19254: R8.2 VT3.1(B)
$1N19268: K3.1 R14.2
$1N19281: K3.4 VD3.1(C) VT3.3(C)
$1N19533: R9.2 VT4.1(B)
$1N19547: K4.1 R15.2
$1N19560: K4.4 VD4.1(C) VT4.3(C)
$1N23681: L1.1 R41.2 R45.2 U6.7(IPK)
$1N61076: J1.1 P1.1 R19.1 T5.1 U3.7(OUT) VD8.1(K) VD9.2(A)
$1N110268: C13.1 U4.4(C2+)
$1N110273: C13.2 U4.5(C2-)
$1N110278: C9.1 U4.1(C1+)
$1N110283: C9.2 U4.3(C1-)
$1N110292: C10.1 U4.2(V+)
$1N110341: C6.2 U1.19(XTAL1) Y1.1(OSC1)
$1N110354: C5.2 U1.18(XTAL2) Y1.2(OSC2)
$1N135967: C23.1 R44.1 U5.10(IN+)
$1N136047: C17.1 R40.1 R44.2
$1N136085: C28.2 R53.2 R54.1 U5.12(IN+)
$1N136120: R32.2 R40.2 T9.1 U5.7(OUT)
$1N153519: R43.2 R48.2 U6.5(COMP)
$1N153534: C24.1 L2.1 R43.1 VD14.1(C)
$1N161943: J3.2 U4.14(T1OUT)
$1N161952: J3.3 U4.13(R1IN)
$1N174845: P2.2 S7.2
$1N174849: C32.1 R58.2 U9.3(VIN)
$1N174850: F1.1 S7.1
$1N187286: LED1.1(A) R23.2

Not connected (* = marked no-connect by the designer): J3 1* 4* 6* 7* 8* 9* 10(MH1)* 11(MH2)*; K1 2*; K2 2*; K3 2*; K4 2*; P1 2*; S1 1(A)* 4(D)*; S2 1(A)* 4(D)*; S3 1(A)* 4(D)*; S4 1(A)* 4(D)*; S5 1(A)* 4(D)*; S6 1(A)* 4(D)*; S7 3* 4* 5* 6*; U1 21(P2.0/A8)* 22(P2.1/A9)* 29(NA/P4.4)* 30(ALE/P4.5)*; U4 7(T2OUT)* 8(R2IN)* 9(R2OUT)* 10(T2IN)*

## Notes on the sheet
- 单片机模块
- 电源模块
- RS485烧录
- 声光电模块
- 电容测量
- 测量挡位切换
